# EAGLE design Backplate_2 (EAGLE 9.6.2)
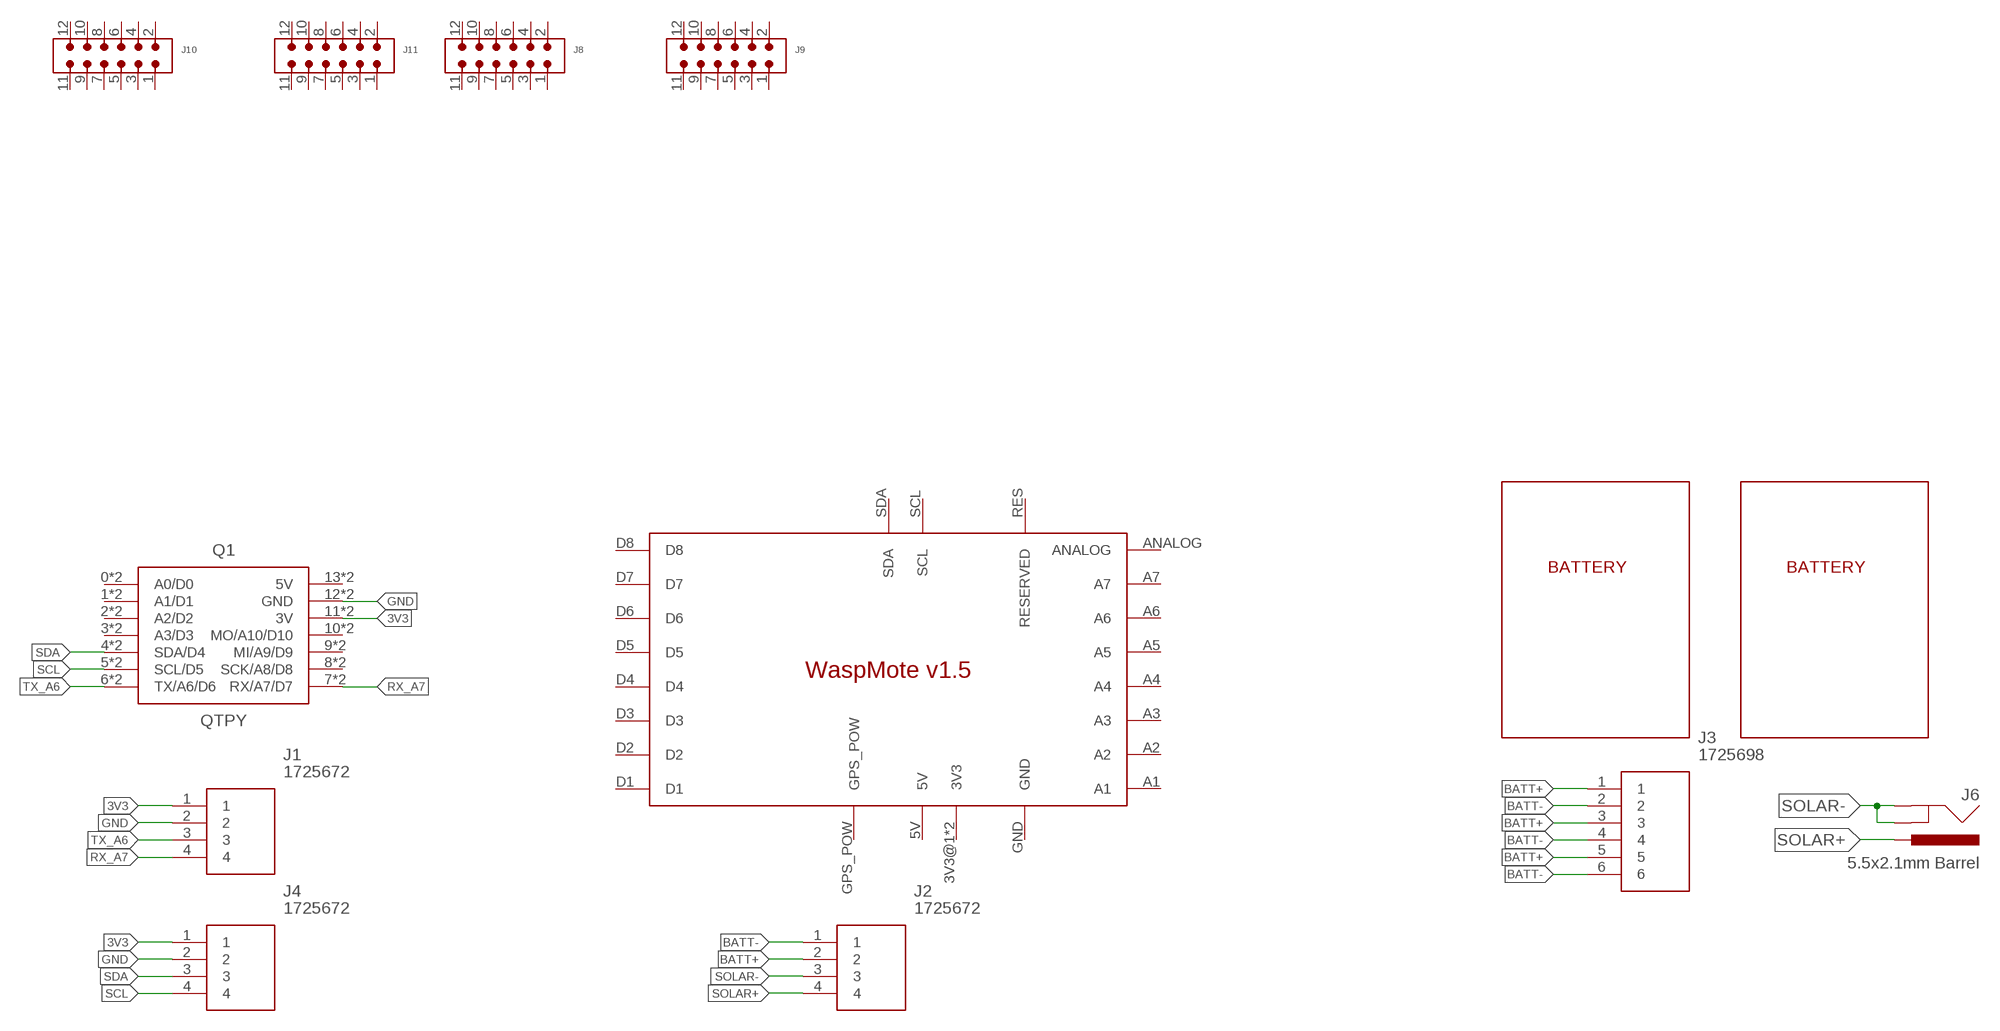
[diagram p0: schematic, sheet 1]

## Parts
J1  1725672  [1725672-4-2.54]
J2  1725672  [1725672-4-2.54]
J3  1725698  [SHDR6W90P0X254_1X6_1570X620X85]
J4  1725672  [1725672-4-2.54]
J6  5.5x2.1mm Barrel  POWER_JACK  [POWER_JACK_PTH]
J8  6130XX21021_61301221021  [61301221021]
J9  6130XX21021_61301221021  [61301221021]
J10  6130XX21021_61301221021  [61301221021]
J11  6130XX21021_61301221021  [61301221021]
Q1  QTPY  [QTPY]
U$1  BATTERY  [BATTERY]
U$2  BATTERY  [BATTERY]
U$12  WASPMOTE_V1.5  [WASPMOTE_V1.5]

## Nets
3V3: J1.1 J4.1 Q1.11(3V) Q1.11C(3V)
BATT+: J2.2 J3.1 J3.3 J3.5
BATT-: J2.1 J3.2 J3.4 J3.6
GND: J1.2 J4.2 Q1.12(GND) Q1.12C(GND)
RX_A7: J1.4 Q1.7(RX/A7/D7) Q1.7C(RX/A7/D7)
SCL: J4.4 Q1.5(SCL/D5) Q1.5C(SCL/D5)
SDA: J4.3 Q1.4(SDA/D4) Q1.4C(SDA/D4)
SOLAR+: J2.4 J6.PWR
SOLAR-: J2.3 J6.GND J6.GNDBREAK
TX_A6: J1.3 Q1.6(TX/A6/D6) Q1.6C(TX/A6/D6)
Unconnected: J8.1 J8.2 J8.3 J8.4 J8.5 J8.6 J8.7 J8.8 J8.9 J8.10 J8.11 J8.12 J9.1 J9.2 J9.3 J9.4 J9.5 J9.6 J9.7 J9.8 J9.9 J9.10 J9.11 J9.12 J10.1 J10.2 J10.3 J10.4 J10.5 J10.6 J10.7 J10.8 J10.9 J10.10 J10.11 J10.12 J11.1 J11.2 J11.3 J11.4 J11.5 J11.6 J11.7 J11.8 J11.9 J11.10 J11.11 J11.12 Q1.0(A0/D0) Q1.0C(A0/D0) Q1.1(A1/D1) Q1.1C(A1/D1) Q1.2(A2/D2) Q1.2C(A2/D2) Q1.3(A3/D3) Q1.3C(A3/D3) Q1.8(SCK/A8/D8) Q1.8C(SCK/A8/D8) Q1.9(MI/A9/D9) Q1.9C(MI/A9/D9) Q1.10(MO/A10/D10) Q1.10C(MO/A10/D10) Q1.13(5V) Q1.13C(5V) U$12.3V3@1(3V3) U$12.3V3@2(3V3) U$12.5V U$12.A1 U$12.A2 U$12.A3 U$12.A4 U$12.A5 U$12.A6 U$12.A7 U$12.ANALOG U$12.D1 U$12.D2 U$12.D3 U$12.D4 U$12.D5 U$12.D6 U$12.D7 U$12.D8 U$12.GND U$12.GPS_POW U$12.RES(RESERVED) U$12.SCL U$12.SDA

## Library data of the parts
J1 J2 J4 = Backplate_2:1725672: 4 way vertical PCB terminal,6A 63V Phoenix Contact Non-Fused Terminal Block, 4 Way, Solder Terminals, 26 ??? 20 AWG Through Hole, Nylon, 63 V Source: Datasheet <https://www.phoenixcontact.com/online/portal/us?uri=pxc-oc-itemdetail:pid=1725672&library=usen&tab=1.pdf>; ALLIED_NUMBER: 70054337; DESCRIPTION: 4 way vertical PCB terminal,6A 63V Phoenix Contact Non-Fused Terminal Block, 4 Way, Solder Terminals, 26 ??? 20 AWG Through Hole, Nylon, 63 V; HEIGHT: mm; MANUFACTURER_NAME: Phoenix Contact; MANUFACTURER_PART_NUMBER: 1725672; RS_PART_NUMBER: 3924476; RS_PRICE-STOCK: https://uk.rs-online.com/web/p/products/3924476
J3 = 154N_NAU7802_TH:1725698: 6 way PCB vertical mount terminal,2.54mm 6 way PCB vertical mount terminal,2.54mm Source: Datasheet; ALLIED_NUMBER: 70054339; DESCRIPTION: 6 way PCB vertical mount terminal,2.54mm 6 way PCB vertical mount terminal,2.54mm; HEIGHT: 8.5mm; MANUFACTURER_NAME: Phoenix Contact; MANUFACTURER_PART_NUMBER: 1725698; RS_PART_NUMBER: 3909045; RS_PRICE-STOCK: https://uk.rs-online.com/web/p/products/3909045
J6 = Backplate_2:POWER_JACK: Power Jack Connector This is the standard 5.5mm barrel jack for power. The PTH is the most common, proven, reliable, footprint. The Slot footprint only works if the mill layer is transmitted to the PCB fab house so be warned. Here are the connectors we sell at SparkFun: DC Barrel Power Jack/Connector <https://www.sparkfun.com/products/119> (PRT-00119) DC Barrel Power Jack/Connector (SMD) <https://www.sparkfun.com/products/12748> (PRT-12748) DC Barrel Jack Adapter - Breadboard Compatible <https://www.sparkfun.com/products/10811> (PRT-10811) It is used on this SparkFun product (and many, many others): SparkFun RedBoard - Programmed with Arduino <https://www.sparkfun.com/products/12757> (DEV-12757) Also, if you need a mating power supply or connector, please check these out: Wall Adapter Power Supply - 9VDC 650mA <https://www.sparkfun.com/products/298> (TOL-00298) DC Barrel Jack Adapter - Male <https://www.sparkfun.com/products/10287> (PRT-10287); PROD_ID: CONN-08106; SF_ID: PRT-12748
J8-J11 = Wurth_Connectors_WR-PHD:6130XX21021_61301221021: WR-PHD 2.54 mm THT Angled Dual Pin Header ARTICLE PROPERTIES: Pins:4;​ 6;​ 8;​ 10;​ 12;​ 14;​ 16;​ 18;​ 20;​ 22;​ 24;​ 26;​ 32;​ 34;​ 36;​ 40;​ 64;​ 72 KIND PROPERTIES: Pitch：2.54 mm Quality Class:3 as per CECC 75 301-802 Rows：Dual Gender：Pin Header Type：Angled;​ Board Stacker MATERIAL PROPERTIES: Insulator Material :PA6T Insulator Flammability Rating:UL94 V-0 Contact Material:Copper Alloy Contact Plating:Gold Contact Type:Stamped GENERAL INFORMATION Operating Temperature:-40 up to +105 °C Compliance:RoHS ELECTRICAL PROPERTIES: Rated Current:3 A IR 1:3 A Withstanding Voltage:500 V (AC) Contact Resistance:20 mΩ RISO:1000 MΩ CERTIFICATION UL Approval:E323964 PACKAGING PROPERTIES Packaging:Bag <https://katalog.we-online.com/media/images/v2/o33214v209%20Family_wr-phd_6130XX21021.jpg> Details see: https://katalog.we-online.com/en/em/PHD_2_54_THT_ANGLED_DUAL_PIN_HEADER_6130XX21021 Updated by Yingchun,Shan 2019-10-16 2019 (C) Würth Elektronik; DATASHEET-URL: https://katalog.we-online.com/em/datasheet/61301221021.pdf; GENDER: Pin Header; IR: 3A; MATES: WR-PHD 2.54mm Angled DualSocket Header/Dual Socket Header/Dual Socket Header Bottom Entry/Dual Socket Header Bottom Entry Large/SMT Dual Socket Header/SMT Dual Socket Header Bottom Entry; PACKAGING: Bag; PART-NUMBER: 61301221021; PINS: 12; ROWS: Dual; TYPE: Angled
Q1 = 154N_NAU7802_TH:QTPY
U$1 U$2 = Backplate_2:BATTERY
U$12 = Backplate_2:WASPMOTE_V1.5: WaspMote v1.5 (c) 2017 john.hulth@geo.uio.no

## Board
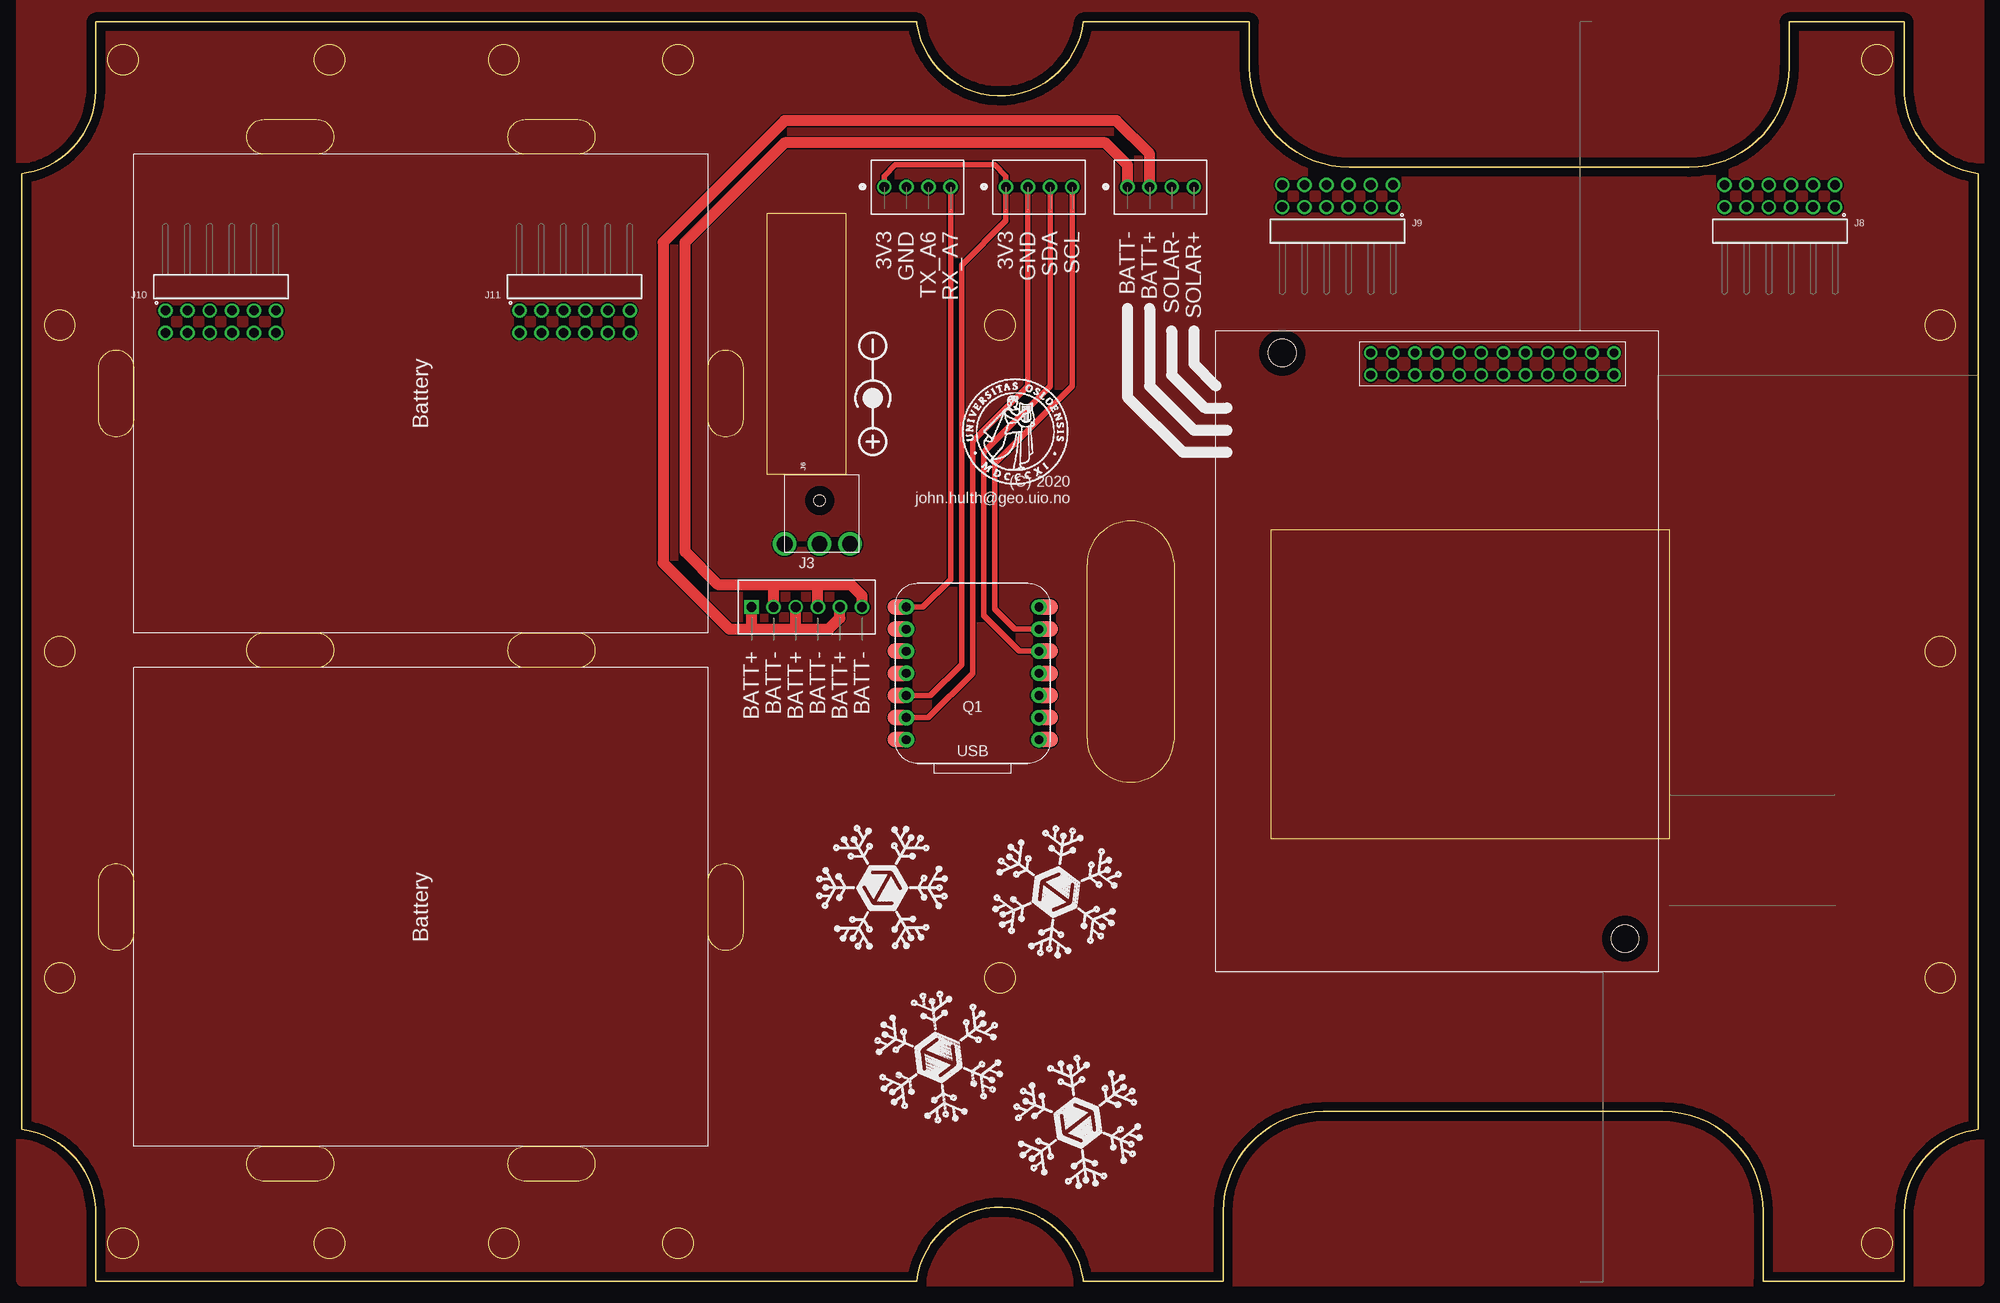
[diagram p1: board, top side]
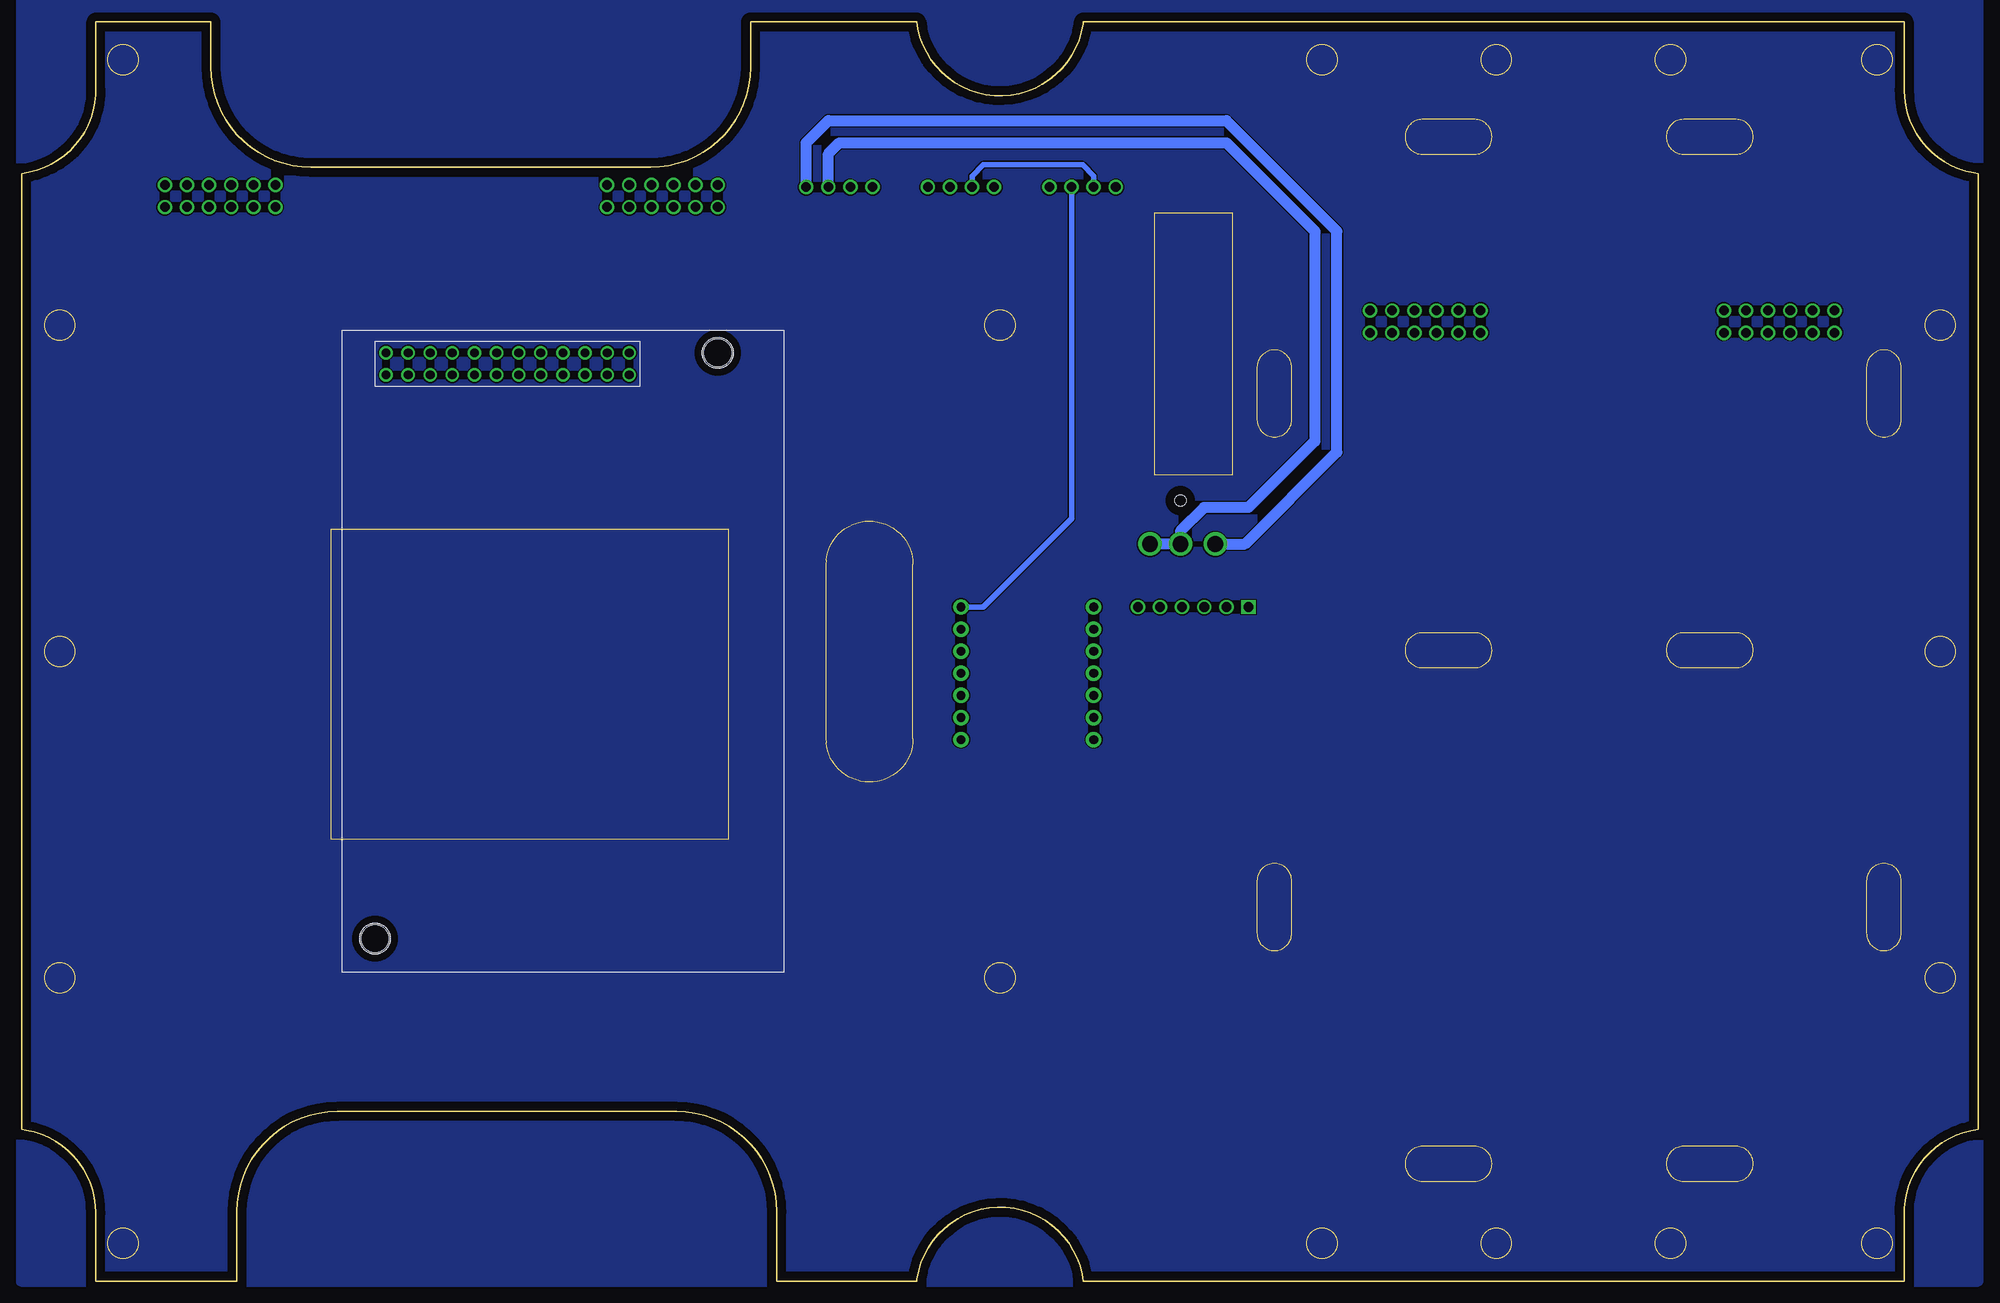
[diagram p2: board, bottom side, seen from below]

Size 224.72 x 144.72 mm. Coordinates in mm from the lower left corner, seen from the top.
Outline: 102.82,144.48 102.78,144.72 8.5,144.72 8.5,136.86 8.46,136.02 arc-75 0.53,127.36 0,127.28 0,17.43 arc-80 8.48,8.4 8.5,7.86 8.5,0 102.78,0 102.92,0.83 arc-160 121.9,0.23 121.93,0 138,0 138,8 arc-90 149.5,19.5 188.5,19.5 arc-90 200,8 200,0 216.22,0 216.22,7.86 216.25,8.7 arc-75 224.18,17.35 224.72,17.43 224.72,127.28 223.89,127.42 arc-75 216.23,136.32 216.22,136.86 216.22,144.72 203,144.72 203,139.5 arc-90 191.5,128 152.5,128 arc-90 141,139.5 141,144.72 121.93,144.72 121.8,143.89 arc-160 102.82,144.48
Copper layers (1*16): Top 0.035mm / dielectric 1.5mm / Bottom 0.035mm
Design rules "default": minimum track width 6mil, minimum drill 0.35mm, track to track 6mil, track to pad 6mil, pad to pad 6mil, via to via 6mil, smd to smd 6mil, copper to edge 40mil, drill to drill 6mil, minimum pad ring 10mil, minimum via ring 8mil, stop-mask expansion 4mil, vias tented up to drill 0mil, thermal gap 10mil
Milling: area 218.6,70.6 to 222.1,74.1; area 211.4,138.6 to 214.9,142.1; area 53.6,2.6 to 57.1,6.1; area 2.6,108.1 to 6.1,111.6; area 211.4,2.6 to 214.9,6.1; area 2.6,33.1 to 6.1,36.6; area 218.6,33.1 to 222.1,36.6; area 33.6,2.6 to 37.1,6.1; area 9.9,138.6 to 13.4,142.1; area 218.6,108.1 to 222.1,111.6; area 110.6,33.1 to 114.1,36.6; area 73.6,138.6 to 77.1,142.1; 6 more areas; 6 lines

### Footprints (pad centres in the part's own frame; a part is rotated, then mirrored left to right if it is on the bottom)
1725672-4-2.54 = drill 1.1 pad 1.65: 1 0,0; 2 2.54,0; 3 5.08,0; 4 7.62,0
SHDR6W90P0X254_1X6_1570X620X85 = drill 1.1 pad 1.65 square: 1 0,0 | drill 1.1 pad 1.65: 2 2.54,0; 3 5.08,0; 4 7.62,0; 5 10.16,0; 6 12.7,0
POWER_JACK_PTH = drill 1.8 pad 2.54: GND 8,7.5; GNDBREAK 8,4; PWR 8,0 | hole 1.3: 3,4
61301221021 = drill 1.1: 1 6.35,2.77; 2 6.35,5.31; 3 3.81,2.77; 4 3.81,5.31; 5 1.27,2.77; 6 1.27,5.31; 7 -1.27,2.77; 8 -1.27,5.31; 9 -3.81,2.77; 10 -3.81,5.31; 11 -6.35,2.77; 12 -6.35,5.31
QTPY = drill 1 pad 1.778: 0 -7.62,7.62; 1 -7.62,5.08; 2 -7.62,2.54; 3 -7.62,0; 4 -7.62,-2.54; 5 -7.62,-5.08; 6 -7.62,-7.62; 7 7.62,-7.62; 8 7.62,-5.08; 9 7.62,-2.54; 10 7.62,0; 11 7.62,2.54; 12 7.62,5.08; 13 7.62,7.62 | smd 3.048 x 1.778: 0C -8.255,7.62; 1C -8.255,5.08; 2C -8.255,2.54; 3C -8.255,0; 4C -8.255,-2.54; 5C -8.255,-5.08; 6C -8.255,-7.62; 7C 8.255,-7.62; 8C 8.255,-5.08; 9C 8.255,-2.54; 10C 8.255,0; 11C 8.255,2.54; 12C 8.255,5.08; 13C 8.255,7.62
WASPMOTE_V1.5 = drill 1.016: 3V3@1 5.08,45.72; 3V3@2 2.54,22.86; 5V 5.08,20.32; A1 5.08,22.86; A2 2.54,25.4; A3 5.08,25.4; A4 2.54,27.94; A5 5.08,27.94; A6 2.54,30.48; A7 5.08,30.48; ANALOG 2.54,45.72; D1 5.08,33.02; D2 2.54,35.56; D3 5.08,35.56; D4 2.54,38.1; D5 5.08,38.1; D6 2.54,40.64; D7 5.08,40.64; D8 2.54,43.18; GND 5.08,43.18; GPS_POW 2.54,20.32; RES 2.54,33.02; SCL 5.08,17.78; SDA 2.54,17.78 | hole 3.2: 2.54,7.62; 69.85,46.99

### Placement (x,y rotation side)
J1  99.06,125.73 0 top
J2  127,125.73 0 top
J3  83.82,77.47 0 top
J4  113.03,125.73 0 top
J6  87.63,92.71 270 top
J8  201.93,120.65 0 top
J9  151.13,120.65 0 top
J10  22.86,114.3 180 top
J11  63.5,114.3 180 top
Q1  109.22,69.85 180 top
U$1  45.84,43 90 top
U$2  45.84,102 90 top
U$3  [UIO-LOGO-BL]  107.78,91.29 0 top
U$4  [HIVE-LOGO]  98.83,45.22 60 top
U$5  [HIVE-LOGO]  118.83,44.72 323 top
U$6  [HIVE-LOGO]  105.33,25.72 337 top
U$7  [HIVE-LOGO]  121.33,18.22 38 top
U$12  137.16,109.22 270 top

### Tracks (layer width: path | path; a pad name or v marks a point on that pad's centre or on a via)
3V3
  Top 0.61: Q1.11C 104.37,67.31 107.95,70.89 107.95,116.76 113.03,121.84 J4.1 113.03,127 111.76,128.27 100.33,128.27 99.06,127 J1.1
BATT+
  Top 1.27: J2.2 129.54,129.54 125.73,133.35 87.63,133.35 73.66,119.38 73.66,82.55 81.28,74.93 83.82,74.93 | J3.5 93.98,76.2 92.71,74.93 88.9,74.93 | 83.82,74.93 88.9,74.93 | 88.9,74.93 J3.3 | 83.82,74.93 J3.1
BATT-
  Top 1.27: J2.1 127,128.27 124.46,130.81 87.63,130.81 76.2,119.38 76.2,83.82 80.01,80.01 86.36,80.01 | J3.6 96.52,78.74 95.25,80.01 91.44,80.01 | 91.44,80.01 86.36,80.01 | J3.2 86.36,80.01 | J3.4 91.44,80.01
BOTTOM
  pour Bottom: 0,0 0,149.86 224.79,149.86 224.79,0
GND
  Top 0.61: Q1.12C 104.14,64.77 109.22,69.85 109.22,96.52 115.57,102.87 J4.2
  Bottom 0.61: J4.2 115.57,127 114.3,128.27 102.87,128.27 101.6,127 J1.2
RX_A7
  Top 0.61: Q1.7C 103.5,77.47 106.68,80.64 J1.4
SCL
  Top 0.61: Q1.5 114.07,74.93 111.76,77.24 111.76,93.98 120.65,102.87 J4.4
SDA
  Top 0.61: Q1.4 114.57,72.39 110.49,76.47 110.49,95.25 118.11,102.87 J4.3
SOLAR+
  Bottom 1.27: J2.4 134.62,130.81 132.08,133.35 86.36,133.35 73.66,120.65 73.66,95.25 84.2,84.71 J6.PWR
SOLAR-
  Bottom 1.27: J2.3 132.08,129.54 130.81,130.81 86.36,130.81 76.2,120.65 76.2,96.52 83.82,88.9 88.9,88.9 91.63,86.17 J6.GNDBREAK J6.GND
TOP
  pour Top: 0,0 0,153.67 224.79,153.67 224.79,0
TX_A6
  Bottom 0.61: Q1.6 114.3,77.47 104.14,87.63 J1.3

### Text on the board
tPlace: 3V3 | GND | TX_A6 | RX_A7 | 3V3 | GND | SDA | SCL | BATT- | BATT+ | SOLAR- | SOLAR+ | (C) 2020 / john.hulth@geo.uio.no | BATT+ | BATT- | BATT+ | BATT- | BATT+ | BATT-